# EAGLE board Data Logger V3.1 (EAGLE 9.4.0)
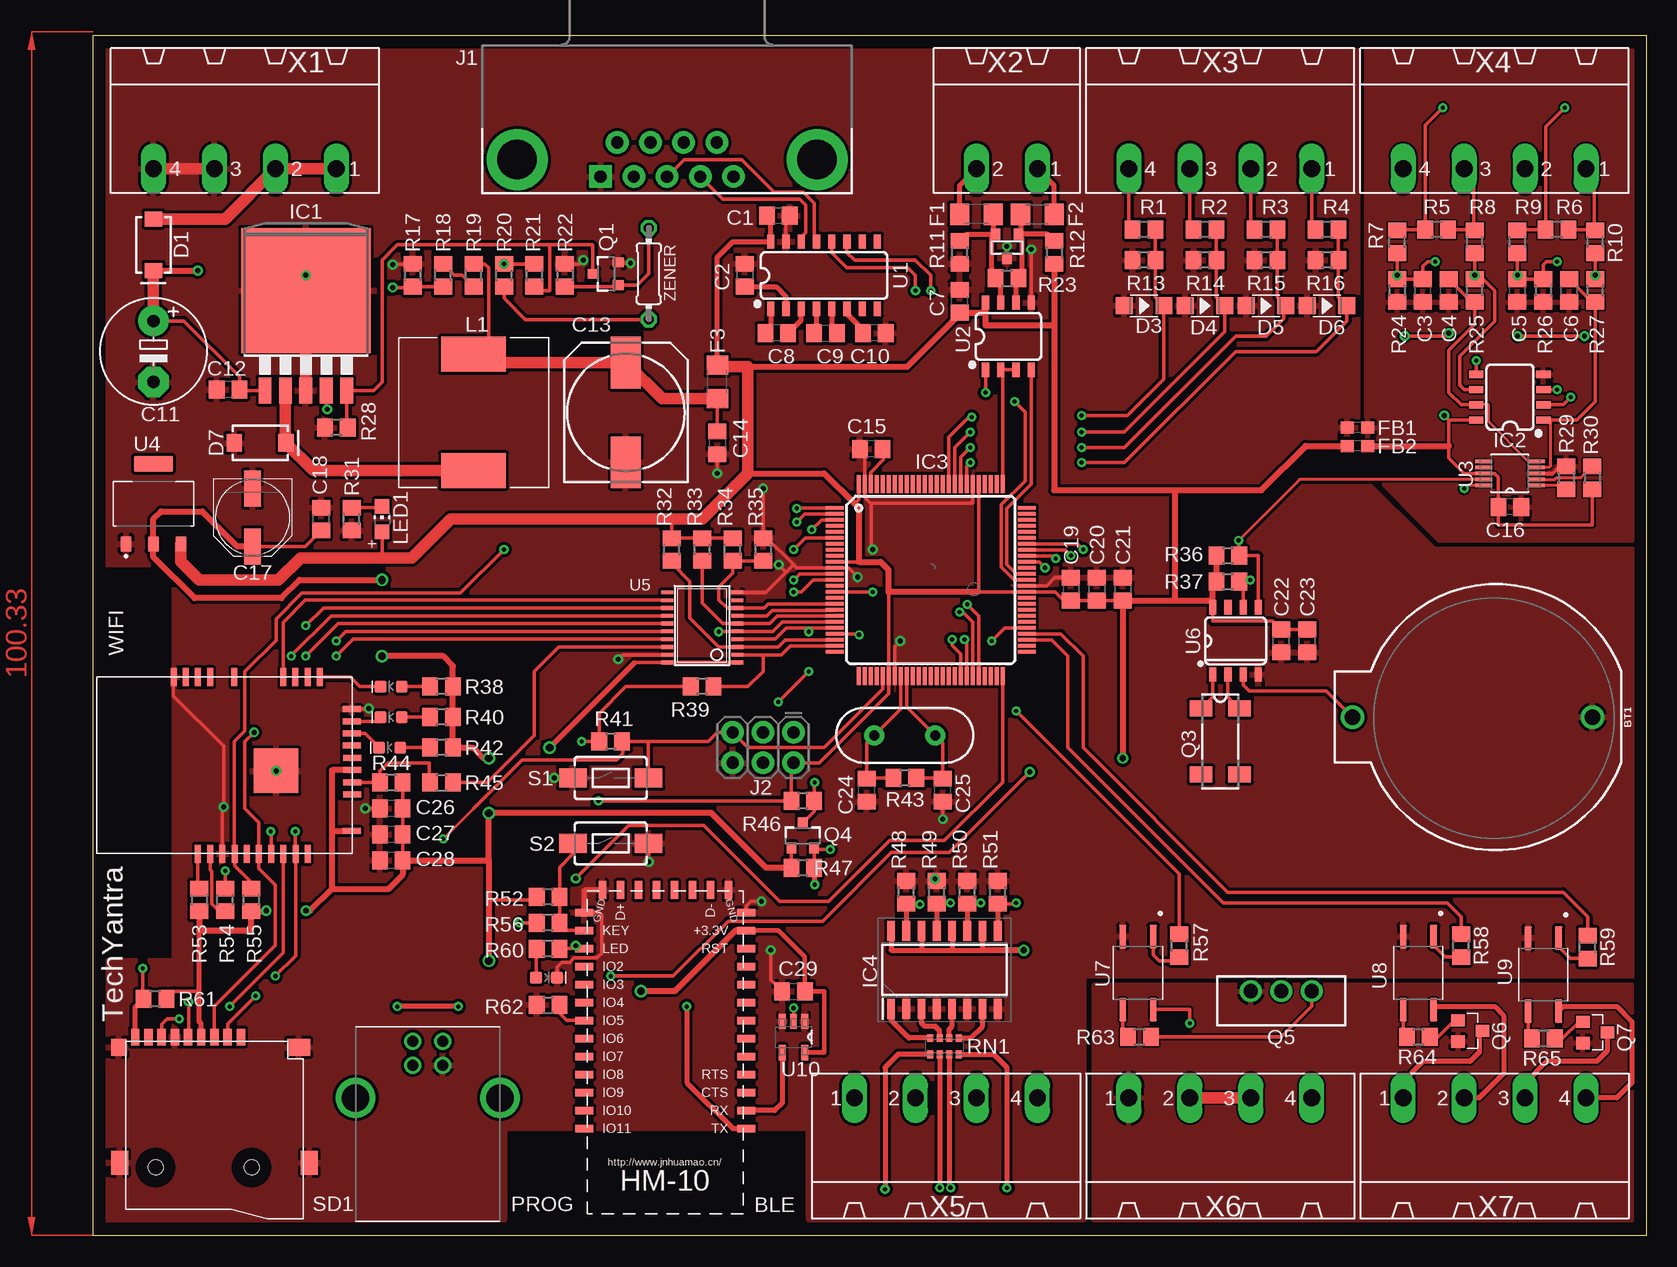
[diagram p3: board, top side]
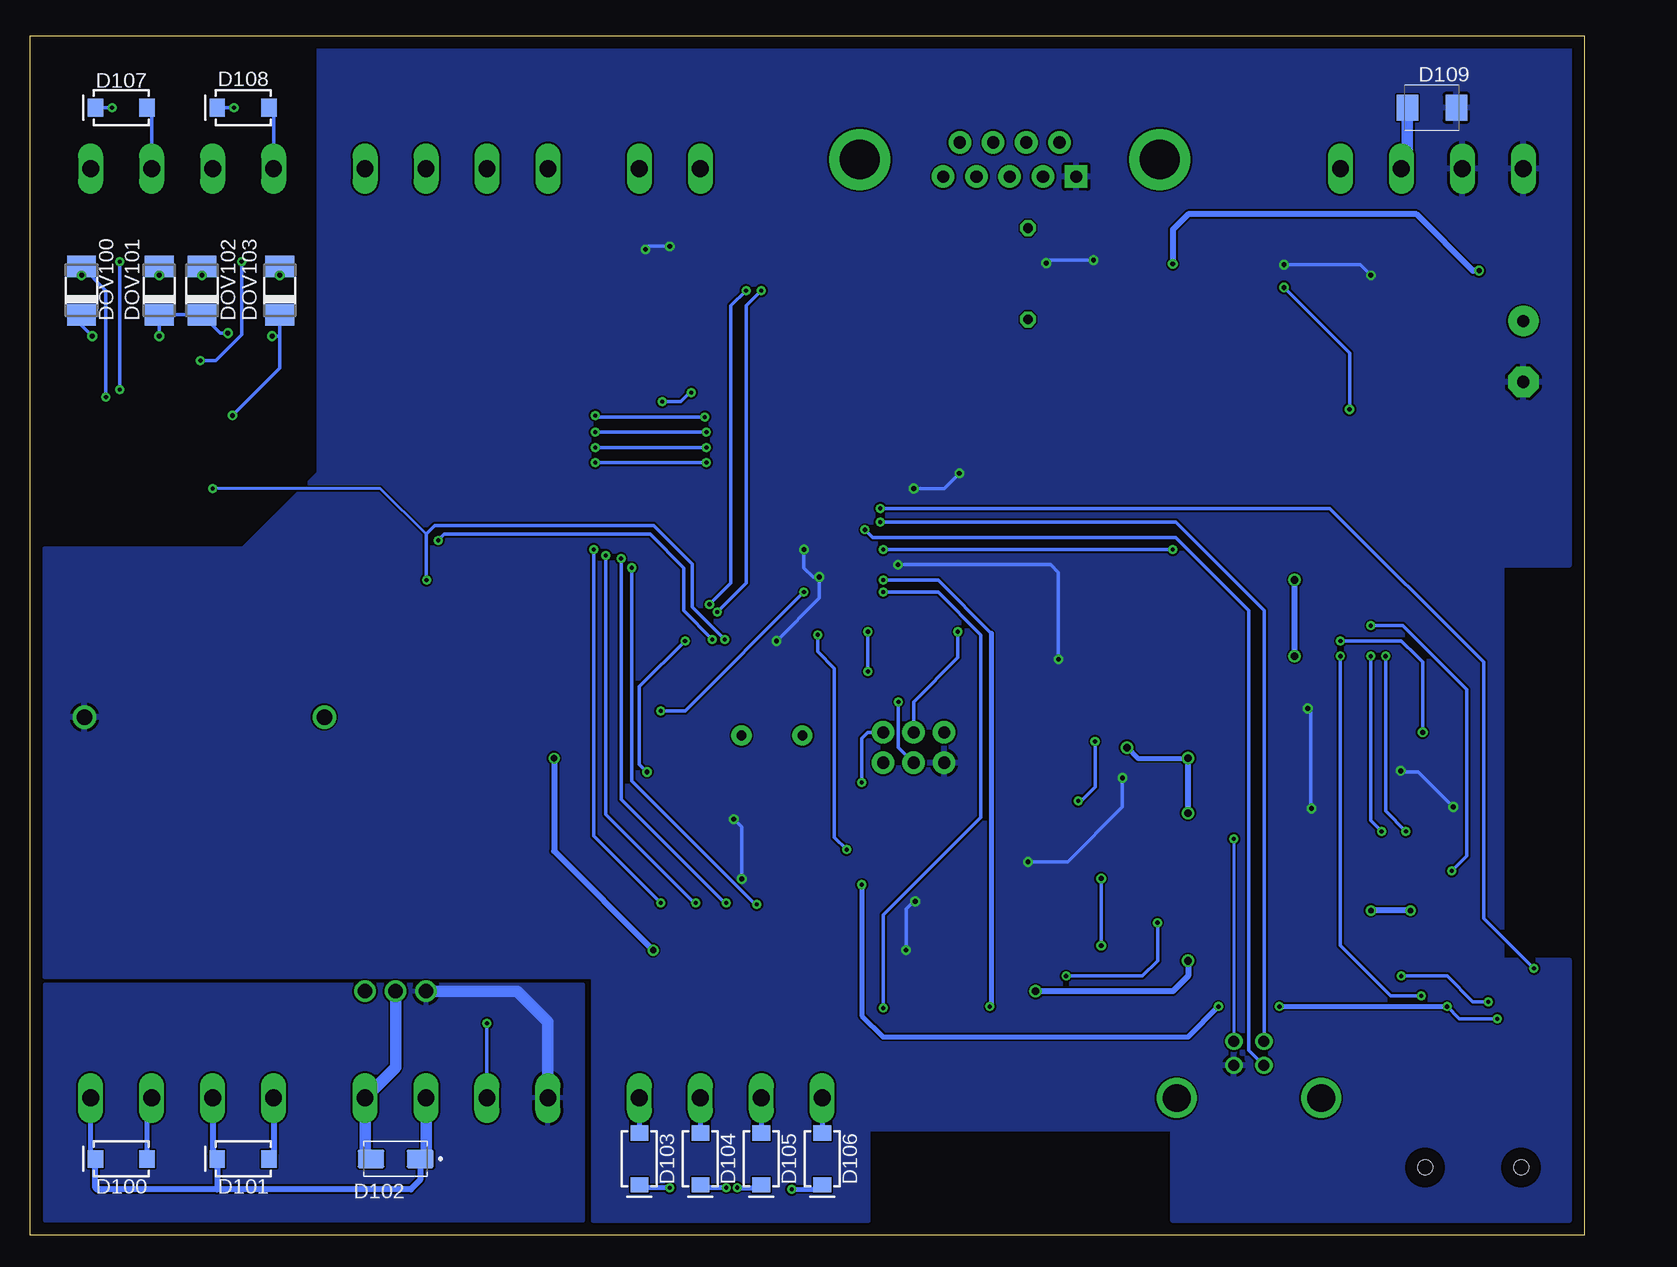
[diagram p4: board, bottom side, seen from below]

Size 129.52 x 100 mm. Coordinates in mm from the lower left corner, seen from the top.
Outline: 0,0 129.52,0 129.52,100 0,100 0,0
Copper layers (1*16): Top 0.035mm / dielectric 1.5mm / Bottom 0.035mm
Design rules "default": minimum track width 6mil, minimum drill 0.35mm, track to track 6mil, track to pad 6mil, pad to pad 6mil, via to via 6mil, smd to smd 6mil, copper to edge 40mil, drill to drill 6mil, minimum pad ring 10mil, minimum via ring 8mil, stop-mask expansion 4mil, vias tented up to drill 0mil, thermal gap 10mil

## Footprints (pad centres in the part's own frame; a part is rotated, then mirrored left to right if it is on the bottom)
26.9X13X2.2_BOARD = smd 1.5 x 0.635: 1 -7.5,0; 2 -7.5,-1.5; 3 -7.5,-3; 4 -7.5,-4.5; 5 -7.5,-6; 6 -7.5,-7.5; 8 -7.5,-10.5; 9 -7.5,-12; 10 -7.5,-13.5; 11 -7.5,-15; 12 -7.5,-16.5; 13 -7.5,-18; 22 6,-18; 23 6,-16.5; 24 6,-15; 25 6,-13.5; 26 6,-12; 27 6,-10.5; 28 6,-9; 29 6,-7.5; 30 6,-6; 31 6,-4.5; 32 6,-3; 33 6,-1.5; 34 6,0; $7 -7.5,-9 | smd 0.635 x 1.5: 14 -6,-19.875; 15 -4.5,-19.875; 16 -3,-19.875; 17 -1.5,-19.875; 18 0,-19.875; 19 1.5,-19.875; 20 3,-19.875; 21 4.5,-19.875
BATTCOM_20MM_PTH = drill 1.3: 1 11.85,0; 2 -8.15,0
C0805 = smd 1.3 x 1.5: 1 -0.95,0; 2 0.95,0
E5-8,5 = drill 1.016 pad 2.54: + -2.54,0 | drill 1.016 pad 2.54 octagon: - 2.54,0
150CLZ-1014 = smd 4.3 x 2.5: + 4.15,0; - -4.15,0
PANASONIC_D = smd 3 x 1.4: + 2.4,0; - -2.4,0
SMA-DIODE = smd 1.27 x 1.47: A -2.15,0; C 2.15,0
SOT-23-3 = smd 0.802 x 0.972: 1 -0.95,-1; 2 0.95,-1; 3 0,1
SOD-123 = smd 1.397 x 1.397: + -1.651,0; - 1.651,0
LED-0603 = smd 1 x 1: A -0.877,0; C 0.877,0
DIOM505270X240 = smd 2.21 x 1.53: A 2.05,0; C -2.05,0
SMBJ = smd 1.78 x 2.16: A 2.04,0; C -2.03,0
DO-214AC = smd 1.8 x 2.4: A 2.025,0; C -2.025,0
1206 = smd 1.6 x 1.8: 1 -1.4,0; 2 1.4,0
0603 = smd 1.1 x 1: 1 -0.85,0; 2 0.85,0
TO263-5 = smd 1.067 x 2.159: 1 -3.404,-5.791; 2 -1.702,-5.791; 3 0,-5.791; 4 1.702,-5.791; 5 3.404,-5.791 | smd 10.8 x 10.41: 6 0,2.54
SO08 = smd 0.6 x 1.2: 1 -1.905,-2.8; 2 -0.635,-2.8; 3 0.635,-2.8; 4 1.905,-2.8; 5 1.905,2.8; 6 0.635,2.8; 7 -0.635,2.8; 8 -1.905,2.8
TQFP100 = smd 1.5 x 0.3: 1 -8,6; 2 -8,5.5; 3 -8,5; 4 -8,4.5; 5 -8,4; 6 -8,3.5; 7 -8,3; 8 -8,2.5; 9 -8,2; 10 -8,1.5; 11 -8,1; 12 -8,0.5; 13 -8,0; 14 -8,-0.5; 15 -8,-1; 16 -8,-1.5; 17 -8,-2; 18 -8,-2.5; 19 -8,-3; 20 -8,-3.5; 21 -8,-4; 22 -8,-4.5; 23 -8,-5; 24 -8,-5.5; 25 -8,-6; 51 8,-6; 52 8,-5.5; 53 8,-5; 54 8,-4.5; 55 8,-4; 56 8,-3.5; 57 8,-3; 58 8,-2.5; 59 8,-2; 60 8,-1.5; 61 8,-1; 62 8,-0.5; 63 8,0; 64 8,0.5; 65 8,1; 66 8,1.5; 67 8,2; 68 8,2.5; 69 8,3; 70 8,3.5; 71 8,4; 72 8,4.5; 73 8,5; 74 8,5.5; 75 8,6 | smd 0.3 x 1.5: 26 -6,-8; 27 -5.5,-8; 28 -5,-8; 29 -4.5,-8; 30 -4,-8; 31 -3.5,-8; 32 -3,-8; 33 -2.5,-8; 34 -2,-8; 35 -1.5,-8; 36 -1,-8; 37 -0.5,-8; 38 0,-8; 39 0.5,-8; 40 1,-8; 41 1.5,-8; 42 2,-8; 43 2.5,-8; 44 3,-8; 45 3.5,-8; 46 4,-8; 47 4.5,-8; 48 5,-8; 49 5.5,-8; 50 6,-8; 76 6,8; 77 5.5,8; 78 5,8; 79 4.5,8; 80 4,8; 81 3.5,8; 82 3,8; 83 2.5,8; 84 2,8; 85 1.5,8; 86 1,8; 87 0.5,8; 88 0,8; 89 -0.5,8; 90 -1,8; 91 -1.5,8; 92 -2,8; 93 -2.5,8; 94 -3,8; 95 -3.5,8; 96 -4,8; 97 -4.5,8; 98 -5,8; 99 -5.5,8; 100 -6,8
SOIC127P700X230-16N = smd 1.65 x 0.65: 1 -3.25,4.445; 2 -3.25,3.175; 3 -3.25,1.905; 4 -3.25,0.635; 5 -3.25,-0.635; 6 -3.25,-1.905; 7 -3.25,-3.175; 8 -3.25,-4.445; 9 3.25,-4.445; 10 3.25,-3.175; 11 3.25,-1.905; 12 3.25,-0.635; 13 3.25,0.635; 14 3.25,1.905; 15 3.25,3.175; 16 3.25,4.445
DB9_MALE = drill 1.016 pad 1.88: 1 5.54,-1.42; 2 2.77,-1.42; 3 0,-1.42; 4 -2.77,-1.42; 6 4.15,1.42; 7 1.38,1.42; 8 -1.38,1.42; 9 -4.15,1.42 | drill 1.016 pad 1.88 square: 5 -5.54,-1.42 | drill 3.302 pad 5.08: G1 -12.5,0; G2 12.5,0
2X3-NS = drill 1.016 pad 1.88: 1 -2.54,-1.27; 2 -2.54,1.27; 3 0,-1.27; 4 0,1.27; 5 2.54,-1.27; 6 2.54,1.27
INDP125125X600N = smd 2.9 x 5.4: 1 -4.85,0; 2 4.85,0
CHIP-LED0805 = smd 1.2 x 1.2: A 0,-1.05; C 0,1.05
61400416121 = drill 0.92: 1 1.25,4.71; 2 -1.25,4.71; 3 -1.25,2.71; 4 1.25,2.71 | drill 2.3: Z1 -6.02,0; Z2 6.02,0
SOT23-3 = smd 0.8 x 0.9: 1 -0.95,-1; 2 0.95,-1; 3 0,1.1
HC49US = drill 0.813 pad 1.676: 1 -2.54,0; 2 2.54,0
MC-306 = smd 1.3 x 1.9: 1 -2.75,-1.6; 2 2.75,-1.6; 3 2.75,1.6; 4 -2.75,1.6
TO220 = drill 1.2 pad 1.8: 1 -2.54,0; 2 0,0; 3 2.54,0
SOT-23 = smd 1.016 x 1.143: 1 -0.889,-1.016; 2 0.889,-1.016; 3 0,1.016
R0805 = smd 1.3 x 1.5: 1 -0.95,0; 2 0.95,0
CAY16 = smd 0.5 x 0.65: 1 -1.2,-0.675; 2 -0.4,-0.675; 3 0.4,-0.675; 4 1.2,-0.675; 5 1.2,0.675; 6 0.4,0.675; 7 -0.4,0.675; 8 -1.2,0.675
TACTILE_SWITCH_SMD_6.0X3.5MM = smd 2.3 x 1.6: 1 -3.15,0; 2 3.15,0
TF-PULL = smd 0.7 x 1.4: 1 -2.2,-7.62; 2 -1.1,-7.62; 3 0,-7.62; 4 1.1,-7.62; 5 2.2,-7.62; 6 3.3,-7.62; 7 4.4,-7.62; 8 5.5,-7.62; 9 6.6,-7.62 | smd 1.4 x 2: S1 -7.9,2.85; S2 7.9,2.85 | smd 1.28 x 1.4: S3 7.96,-6.75 | smd 1.95 x 1.4: S4 -7.025,-6.75 | hole 1.25: -3.1,3.25; 4.9,3.25
SO16 = smd 0.6 x 1.2: 1 -4.445,-2.8; 2 -3.175,-2.8; 3 -1.905,-2.8; 4 -0.635,-2.8; 5 0.635,-2.8; 6 1.905,-2.8; 7 3.175,-2.8; 8 4.445,-2.8; 9 4.445,2.8; 10 3.175,2.8; 11 1.905,2.8; 12 0.635,2.8; 13 -0.635,2.8; 14 -1.905,2.8; 15 -3.175,2.8; 16 -4.445,2.8
SOP50P490X110-10N = smd 1.422 x 0.279: 1 -2.184,0.991; 2 -2.184,0.508; 3 -2.184,0; 4 -2.184,-0.508; 5 -2.184,-0.991; 6 2.184,-0.991; 7 2.184,-0.508; 8 2.184,0; 9 2.184,0.508; 10 2.184,0.991
SOT229P700X180-4N = smd 0.93 x 1.31: 1 -2.29,-3.345; 2 0,-3.345; 3 2.29,-3.345 | smd 3.24 x 1.31: 4 0,3.345
TSSOP20 = smd 0.305 x 0.991: 1 -3.075,-2.918; 2 -2.425,-2.918; 3 -1.775,-2.918; 4 -1.125,-2.918; 5 -0.475,-2.918; 6 0.175,-2.918; 7 0.825,-2.918; 8 1.475,-2.918; 9 2.125,-2.918; 10 2.775,-2.918; 11 2.775,2.918; 12 2.125,2.918; 13 1.475,2.918; 14 0.825,2.918; 15 0.175,2.918; 16 -0.475,2.918; 17 -1.125,2.918; 18 -1.775,2.918; 19 -2.425,2.918; 20 -3.075,2.918
SO08-0.15 = smd 0.6 x 1.2: 1 -1.905,-2.8; 2 -0.635,-2.8; 3 0.635,-2.8; 4 1.905,-2.8; 5 1.905,2.8; 6 0.635,2.8; 7 -0.635,2.8; 8 -1.905,2.8
SOP254P700X200-4N = smd 1.93 x 0.59: 1 -3.04,1.27; 2 -3.04,-1.27; 3 3.04,-1.27; 4 3.04,1.27
SOT95P280X145-5N = smd 1.27 x 0.559: 1 -1.295,0.94; 2 -1.295,0; 3 -1.295,-0.94; 4 1.295,-0.94; 5 1.295,0.94
ATWINC1500_MR210PA = smd 1.5 x 0.5: J1 7.146,-4.973; J2 7.146,-3.957; J3 7.146,-2.941; J4 7.146,-1.925; J5 7.146,2.139; J6 7.146,4.171; J7 7.146,5.187; J8 7.146,6.203; J9 7.146,7.219; J10 -7.584,5.181; J11 -7.584,4.165; J12 -7.584,3.149; J13 -7.584,2.133; J14 -7.584,1.117; J15 -7.584,0.101; J16 -7.584,-0.915; J17 -7.584,-1.931; J18 -7.584,-2.947; J19 -7.584,-3.963 | smd 0.5 x 1.5: J20 -5.684,-7.643; J21 -2.636,-7.663; J22 -1.62,-7.663; J23 -0.604,-7.663; J24 0.412,-7.663; J25 1.428,-7.643; J26 2.444,-7.643; J27 3.46,-7.643; J28 4.476,-7.643 | smd 3.7 x 3.7: MTGND -0.666,-1.331
MSTBA4 = drill 1.397 long: 1 -7.62,5.08; 2 -2.54,5.08; 3 2.54,5.08; 4 7.62,5.08
MSTBA2 = drill 1.397 long: 1 -2.54,5.08; 2 2.54,5.08
0204/7 = drill 0.813 octagon: 1 -3.81,0; 2 3.81,0

## Placement (x,y rotation side)
BLE  HM-10-BOARD  [26.9X13X2.2_BOARD]  46.99,8.89 180 top
BT1  [BATTCOM_20MM_PTH]  116.84,43.18 180 top
C1  0.1uf  [C0805]  57.15,84.96 180 top
C2  0.1uf  [C0805]  54.36,80.01 270 top
C3  0.1uf  [C0805]  110.87,78.74 90 top
C4  0.1uf  [C0805]  113.03,78.74 90 top
C5  0.1uf  [C0805]  118.75,78.74 90 top
C6  0.1uf  [C0805]  123.06,78.74 90 top
C7  104  [C0805]  72.26,77.85 90 top
C8  0.1uf  [C0805]  57.02,75.18 180 top
C9  0.1uf  [C0805]  61.09,75.18 0 top
C10  0.1uf  [C0805]  65.15,75.18 180 top
C11  470uf  [E5-8,5]  5.08,73.66 270 top
C12  104  [C0805]  11.3,70.48 180 top
C13  220uf  [150CLZ-1014]  44.45,68.58 90 top
C14  104  [C0805]  52.07,66.04 270 top
C15  104  [C0805]  64.9,65.53 180 top
C16  0.1uf  [C0805]  118.11,60.71 180 top
C17  100uF  [PANASONIC_D]  13.34,59.82 270 top
C18  104  [C0805]  19.05,59.69 90 top
C19  104  [C0805]  81.53,53.85 270 top
C20  104  [C0805]  83.69,53.85 270 top
C21  104  [C0805]  85.85,53.85 270 top
C22  10uf  [C0805]  99.06,49.53 90 top
C23  104  [C0805]  101.22,49.53 90 top
C24  104  [C0805]  64.52,37.08 90 top
C25  104  [C0805]  70.87,37.08 90 top
C26  10uf  [C0805]  24.89,35.56 180 top
C27  10uf  [C0805]  24.89,33.4 180 top
C28  104  [C0805]  24.89,31.24 180 top
C29  1uf  [C0805]  58.42,20.32 0 top
D1  3A/40V/500mV  [SMA-DIODE]  5.08,82.55 270 top
D2  SM712  [SOT-23-3]  76.2,82.42 180 top
D3  SMD-DIODE-ZENER-5.1V-500MW(SOD-123)  [SOD-123]  87.63,77.47 0 top
D4  SMD-DIODE-ZENER-5.1V-500MW(SOD-123)  [SOD-123]  92.71,77.47 0 top
D5  SMD-DIODE-ZENER-5.1V-500MW(SOD-123)  [SOD-123]  97.79,77.47 0 top
D6  SMD-DIODE-ZENER-5.1V-500MW(SOD-123)  [SOD-123]  102.87,77.47 0 top
D7  3A/40V/500mV  [SMA-DIODE]  13.97,66.04 0 top
D8  LED3  [LED-0603]  24.89,45.72 180 top
D9  LED2  [LED-0603]  24.89,43.18 180 top
D10  LED1  [LED-0603]  24.77,40.64 180 top
D11  LED5  [LED-0603]  37.85,21.46 0 top
D100  3A/40V/500mV  [SMA-DIODE]  121.92,6.35 180 bottom
D101  3A/40V/500mV  [SMA-DIODE]  111.76,6.35 180 bottom
D102  M7  [DIOM505270X240]  99.06,6.35 180 bottom
D103  3A/40V/500mV  [SMA-DIODE]  78.74,6.35 270 bottom
D104  3A/40V/500mV  [SMA-DIODE]  73.66,6.35 270 bottom
D105  3A/40V/500mV  [SMA-DIODE]  68.58,6.35 270 bottom
D106  3A/40V/500mV  [SMA-DIODE]  63.5,6.35 270 bottom
D107  3A/40V/500mV  [SMA-DIODE]  121.92,93.98 180 bottom
D108  3A/40V/500mV  [SMA-DIODE]  111.76,93.98 180 bottom
D109  SMBJ26CA  [SMBJ]  12.7,93.98 0 bottom
DOV100  SS14  [DO-214AC]  125.22,78.74 90 bottom
DOV101  SS14  [DO-214AC]  118.75,78.74 90 bottom
DOV102  SS14  [DO-214AC]  115.19,78.74 90 bottom
DOV103  SS14  [DO-214AC]  108.71,78.74 90 bottom
F1  6V/0.5A  [1206]  73.66,85.09 180 top
F2  6V/0.5A  [1206]  78.74,85.09 0 top
F3  6V/0.5A  [1206]  52.07,71.12 90 top
FB1  30Ω/1.8A  [0603]  105.41,67.31 180 top
FB2  30Ω/1.8A  [0603]  105.41,65.79 180 top
IC1  [TO263-5]  17.78,76.2 0 top
IC2  OP-AMP  [SO08]  118.11,69.85 90 top
IC3  ATMEGA2560-16AU  [TQFP100]  69.85,54.61 0 top
IC4  TLP292-4(V4-LA,E  [SOIC127P700X230-16N]  70.99,22.1 90 top
J1  [DB9_MALE]  47.88,89.66 0 top
J2  AVR_SPI_PROG_3X2NS  [2X3-NS]  55.88,40.64 180 top
L1  SRR1260-680M  [INDP125125X600N]  31.75,68.58 270 top
LED1  [CHIP-LED0805]  24.13,59.69 0 top
PROG  61400416121  [61400416121]  27.94,11.43 0 top
Q1  600mA/40V  [SOT23-3]  42.8,80.14 90 top
Q2  16M  [HC49US]  67.69,41.66 180 top
Q3  MC-306  [MC-306]  93.98,41.15 270 top
Q4  BSS138  [SOT23-3]  59.18,33.27 0 top
Q5  TIP120  [TO220]  99.06,20.32 180 top
Q6  TRANSISTOR-NPN  [SOT-23]  114.81,17.02 270 top
Q7  TRANSISTOR-NPN  [SOT-23]  125.22,16.89 270 top
R1  100k  [R0805]  87.63,83.82 180 top
R2  100k  [R0805]  92.71,83.82 180 top
R3  100k  [R0805]  97.79,83.82 180 top
R4  100k  [R0805]  102.87,83.82 180 top
R5  100  [R0805]  112.01,83.82 180 top
R6  100  [R0805]  122.05,83.82 180 top
R7  1 M  [R0805]  108.71,82.8 90 top
R8  1 M  [R0805]  115.19,82.8 90 top
R9  1 M  [R0805]  118.75,82.8 90 top
R10  1 M  [R0805]  125.22,82.8 90 top
R11  1k  [R0805]  72.26,81.92 90 top
R12  1k  [R0805]  80.14,81.92 270 top
R13  100k  [R0805]  87.63,81.28 180 top
R14  100k  [R0805]  92.71,81.28 180 top
R15  100k  [R0805]  97.79,81.28 180 top
R16  100k  [R0805]  102.87,81.28 180 top
R17  1k  [R0805]  26.67,80.01 270 top
R18  0 ohm  [R0805]  29.21,80.01 90 top
R19  3k  [R0805]  31.75,80.01 90 top
R20  10k  [R0805]  34.29,80.01 90 top
R21  47k  [R0805]  36.83,80.01 90 top
R22  10k  [R0805]  39.37,80.01 270 top
R23  120  [R0805]  76.2,79.76 0 top
R24  1 M  [R0805]  108.71,78.74 270 top
R25  1 M  [R0805]  115.19,78.74 90 top
R26  1 M  [R0805]  120.9,78.74 270 top
R27  1 M  [R0805]  125.22,78.74 90 top
R28  0 ohm  [R0805]  20.32,67.31 180 top
R29  10 K  [R0805]  122.81,63.12 270 top
R30  10 K  [R0805]  124.97,63.12 270 top
R31  1k  [R0805]  21.59,59.69 90 top
R32  100K  [R0805]  48.26,57.15 90 top
R33  100K  [R0805]  50.8,57.15 90 top
R34  0 ohm  [R0805]  53.34,57.15 90 top
R35  100K  [R0805]  55.88,57.15 270 top
R36  2.2k  [R0805]  94.61,56.64 0 top
R37  2.2k  [R0805]  94.61,54.48 0 top
R38  1K  [R0805]  29.08,45.72 180 top
R39  100K  [R0805]  50.8,45.72 180 top
R40  1K  [R0805]  29.08,43.18 180 top
R41  10k  [R0805]  43.18,41.15 180 top
R42  1K  [R0805]  29.08,40.64 180 top
R43  1M  [R0805]  67.69,38.1 180 top
R44  0ohm  [R0805]  24.89,37.72 180 top
R45  0ohm  [R0805]  29.08,37.72 0 top
R46  10K  [R0805]  59.18,36.2 180 top
R47  10K  [R0805]  59.18,30.61 180 top
R48  1 K  [R0805]  67.82,28.57 90 top
R49  1 K  [R0805]  70.36,28.57 90 top
R50  1 K  [R0805]  72.9,28.57 90 top
R51  1 K  [R0805]  75.44,28.57 90 top
R52  10k  [R0805]  37.97,28.19 180 top
R53  100K  [R0805]  8.89,27.94 270 top
R54  0ohm  [R0805]  11.05,27.94 90 top
R55  10K  [R0805]  13.21,27.94 270 top
R56  0 OHM  [R0805]  37.97,26.04 180 top
R57  1K  [R0805]  90.55,24.13 90 top
R58  1K  [R0805]  114.05,24.13 90 top
R59  1K  [R0805]  124.59,24 90 top
R60  1k  [R0805]  37.97,23.88 180 top
R61  1k  [R0805]  5.21,19.68 180 top
R62  0 ohm  [R0805]  37.97,19.18 0 top
R63  10K  [R0805]  87.25,16.51 180 top
R64  1K  [R0805]  110.49,16.51 180 top
R65  1K  [R0805]  120.9,16.38 180 top
RN1  1k  [CAY16]  70.99,15.75 180 top
S1  MOMENTARY-SWITCH-SPST-SMD-6.0X3.5MM  [TACTILE_SWITCH_SMD_6.0X3.5MM]  43.18,38.1 0 top
S2  MOMENTARY-SWITCH-SPST-SMD-6.0X3.5MM  [TACTILE_SWITCH_SMD_6.0X3.5MM]  43.18,32.64 0 top
SD1  TF-HOLDER  [TF-PULL]  10.16,8.89 180 top
U1  MAX3232  [SO16]  60.96,80.01 0 top
U2  MAX3485CSA  [SO08]  76.33,74.93 0 top
U3  ADS1115IDGST  [SOP50P490X110-10N]  118.11,63.5 180 top
U4  AMS1117-3.3  [SOT229P700X180-4N]  5.08,60.96 0 top
U5  74LVC245  [TSSOP20]  50.8,50.8 90 top
U6  DS1307Z  [SO08-0.15]  95.25,49.53 0 top
U7  EL357N(A)(TA)-G  [SOP254P700X200-4N]  87.12,21.84 270 top
U8  EL357N(A)(TA)-G  [SOP254P700X200-4N]  110.49,21.84 270 top
U9  EL357N(A)(TA)-G  [SOP254P700X200-4N]  120.9,21.72 270 top
U10  SN74LVC1G125DBVR  [SOT95P280X145-5N]  58.42,16.51 270 top
WIFI  ATWINC1500_MR210PB  [ATWINC1500_MR210PA]  13.97,39.37 90 top
X1  MSTBA4  [MSTBA4]  12.7,93.98 180 top
X2  MSTBA2  [MSTBA2]  76.2,93.98 180 top
X3  MSTBA4  [MSTBA4]  93.98,93.98 180 top
X4  MSTBA4  [MSTBA4]  116.84,93.98 180 top
X5  MSTBA4  [MSTBA4]  71.12,6.35 0 top
X6  MSTBA4  [MSTBA4]  93.98,6.35 0 top
X7  MSTBA4  [MSTBA4]  116.84,6.35 0 top
ZENER  [0204/7]  46.35,80.14 270 top

## Tracks (layer width: path | path; a pad name or v marks a point on that pad's centre or on a via)
3.3V  (via drill 0.46, 0.64)
  Top 0.305: C17.+ 17.73,57.42 C18.1 | R44.1 C26.1 C27.1 C28.1 | R61.1 6.79,20.32 8.89,20.32 | Q4.1 R47.2 | R52.2 36.77,27.94 33.02,27.94 | U5.1 U5.20 45.19,47.73
  Top 0.381: 60.96,15.24 60.96,20.32 C29.2 59.37,23.18 57.16,25.39 BLE.12 | 60.94,15.21 U10.5
  Top 0.406: 60.96,15.24 60.94,15.21 | SD1.4 9.06,17.61 8.89,17.78 8.89,20.32 8.89,25.4 | 19.97,38.77 19.94,38.73 | 19.94,33.66 19.97,33.69 | C28.1 | 14.42,26.99 v14.48,27.05 | v17.78,27.05 18.16,27.05 | 45.19,47.73 v38.1,40.64
  Top 0.508: C17.+ 12.06,57.42 9.16,60.33 5.71,60.33 5.08,59.69 U4.2 5.08,56.52 8.51,53.09 15.73,53.09 17.26,54.61 v24.13,54.61 | R53.2 8.89,25.4 13.21,25.4 R55.2 14.42,26.99 | 33.02,31.24 C28.1 25.84,30.03 24.64,28.83 19.94,28.83 | WIFI.J23 19.97,38.77 | 19.94,38.73 19.94,33.66 19.94,28.83 | 19.97,33.69 WIFI.J20 | 18.16,27.05 19.94,28.83 | v24.13,48.26 29.21,48.26 30.03,47.44 R38.1 R40.1 R42.1 31.68,40.64 32.57,39.75 v33.02,39.75 | R47.2 56.13,30.61 51.56,35.18 v33.02,35.18 33.02,31.24 | BLE.12 53.58,25.39 48.51,20.32 v45.72,20.32 | 33.02,31.24 33.02,27.94 v33.02,22.86
  Bottom 0.406: v38.1,40.64 37.21,39.75 v33.02,39.75
  Bottom 0.508: v14.48,27.05 v17.78,27.05 | v24.13,48.26 v24.13,54.61 | v45.72,20.32 34.29,20.32 33.02,21.59 v33.02,22.86 | v33.02,35.18 v33.02,39.75
5V  (via drill 0.35, 0.51)
  Top 0.254: 93.28,52.9 93.34,52.83
  Top 0.305: C21.2 C20.2 C19.2 81.09,52.9 81.03,52.83 80.25,53.61 IC3.61 73.79,53.61 73.85,53.67 IC3.80 | 93.34,52.83 U6.8 93.34,51.18 98.36,51.18 C22.2 C23.2 | 93.34,54.16 R37.1 | 65.68,56.11 65.66,56.13 | IC3.10 63.88,56.11 63.85,56.14 | 66.37,53.61 66.35,53.59 IC3.31 66.35,45.14 60.58,39.37 J2.2 58.23,39.18 R46.2 v42.16,36.2 | R34.2 R33.2 R32.2 48.26,59.69 | R39.2 44.45,45.72 42.23,43.5 R41.2 v40.77,41.15 | IC3.100 63.85,61.31 63.5,60.96 | LED1.A 24.13,56.45
  Top 0.406: C1.2 56.52,84.65 U1.16 53.34,82.8 52.07,81.53 F3.2 | IC4.16 66.55,23.75 69.09,23.75 | 69.09,23.75 71.63,23.75 | 71.63,23.75 74.17,23.75 IC4.10 | IC4.12 71.63,23.75 | IC4.14 69.09,23.75
  Top 0.508: R37.1 R36.1 | 93.34,52.83 93.34,54.16 | 66.35,53.59 66.35,55.44 65.68,56.11 63.88,56.11 | 73.79,53.61 66.37,53.61 | R12.2 80.14,75.82 | 80.14,75.82 74.42,75.82 74.42,76.83 | 74.42,76.83 U2.8 | C7.1 72.39,76.9 | 72.39,76.9 74.36,76.9 74.42,76.83 | 90.17,52.9 C21.2 v85.85,39.75 | 90.17,52.9 93.28,52.9 | 54.61,63.5 60.96,63.5 63.5,60.96 63.85,60.61 63.85,56.14 | 54.61,72.39 67.88,72.39 72.39,76.9 | 80.14,75.82 80.14,62.1 90.17,62.1 | 90.17,62.1 97.41,62.1 101.09,65.79 FB2.2 | 90.17,62.1 90.17,52.9 | v77.6,23.75 74.17,23.75
  Top 0.965: U4.3 7.37,56.13 8.89,54.61 15.49,54.61 17.34,56.45 24.13,56.45 26.61,56.45 29.84,59.69 48.26,59.69 50.8,59.69 54.61,63.5 54.61,72.39 52.2,72.39 F3.2
  Bottom 0.305: v42.16,36.2 41.91,36.2 40.77,37.34 v40.77,41.15
  Bottom 0.508: v85.85,39.75 85.85,32 v77.6,23.75
12V  (via drill 0.41)
  Top 0.305: R20.2 R21.2 | IC1.1 12.33,70.41 C12.1 12.25,71.57 7.62,76.2 C11.+
  Top 0.508: D1.C v8.75,80.4 v8.76,80.39 8.89,80.26
  Top 0.965: D1.C C11.+
  Bottom 0.508: v8.76,80.39 9.27,80.39 13.97,85.09 33.02,85.09 34.29,83.82 R20.2
  other vias: 34.29,80.96
!ATWINC_IRQ  (via drill 0.35)
  Top 0.305: R55.1 13.21,29.4 11.84,30.77 WIFI.J13 11.81,31.81 11.81,41.15 12.7,42.04 12.7,46.99 15.29,49.58 15.29,51.37 17.43,53.51 30.65,53.51 v34.29,57.15 | IC3.6 59.38,58.11 v58.42,57.15
  Bottom 0.305: v58.42,57.15 v34.29,57.15
!ATWINC_RST_3V
  Top 0.305: U5.12 17.75,52.92 15.88,51.05 15.88,46.54 WIFI.J4
!ATWINC_RST_5V
  Top 0.305: IC3.17 56.29,52.61 55.96,52.27 U5.8 52.88,52.27 52.2,52.96 52.2,54.04 53.34,55.18 R34.1 R35.2
+12V  (via drill 0.35)
  Top 0.305: U7.4 91.44,18.8 v91.44,17.65
  Top 0.406: U9.4 122.55,19.05 127,19.05 128.27,17.78 128.27,12.7 127,11.43 X7.4 | U8.4 112.01,19.05 116.84,19.05 117.6,18.29 117.6,13.46 115.57,11.43 X7.2
  Top 0.965: X6.3 X6.2
  Bottom 0.305: v91.44,17.65 X6.2
  Bottom 0.406: D100.C 124.2,6.48 124.46,6.74 X7.4
  Bottom 0.508: X7.2 114.3,6.74 D101.C | D102.C 97.01,4.59 97.79,3.81 113.92,3.81 | 114.3,5.96 D101.C | 124.2,6.48 D100.C 124.08,3.94 123.95,3.81 113.92,3.81 | D101.C 113.91,3.82 113.92,3.81
  Bottom 0.965: X6.3 96.52,6.84 D102.C
AGND
  Top 0.279: U3.3 121.67,63.5 122.23,64.07
  Top 0.305: 122.23,64.07 R29.1
  pour Top: 106.17,99.06 128.27,99.06 128.27,57.91 112.27,57.91 106.17,64.01
AIN0
  Top 0.254: U3.4 121.41,64.01 121.54,64.14 121.54,67.94
  Top 0.305: C6.2 124.96,77.79 R27.1 125.22,69.47 123.7,67.94 121.54,67.94 IC2.1
AIN1
  Top 0.254: U3.5 119.66,64.49 116.33,67.82 116.33,69.22 IC2.7
  Top 0.305: C4.2 114.93,77.79 R25.1 115.19,75.95 113.03,73.79 113.03,70.23 114.05,69.22 IC2.7
AIN2  (via drill 0.35)
  Top 0.305: R4.1 R16.1 103.82,78.17 D6.- 104.52,76.2 101.98,73.66 95.25,73.66 85.98,64.39 v82.42,64.39 | IC3.82 72.85,64.09 v73.15,64.39
  Bottom 0.305: v82.42,64.39 v73.15,64.39
AIN3  (via drill 0.35)
  Top 0.305: R3.1 R15.1 98.74,78.17 99.25,77.66 | 99.25,77.66 D5.- | IC3.83 72.35,64.86 v73.15,65.66 | v82.42,65.66 85.98,65.66 95.25,74.93 97.79,74.93 99.25,76.39 99.25,77.66
  Bottom 0.305: v73.15,65.66 v82.42,65.66
AIN4  (via drill 0.35)
  Top 0.305: R2.1 R14.1 93.66,78.17 D4.- 94.36,75.31 85.98,66.93 v82.42,66.93 | IC3.84 71.85,65.63 v73.15,66.93
  Bottom 0.305: v73.15,66.93 v82.42,66.93
AIN5  (via drill 0.35)
  Top 0.305: R1.1 R13.1 88.58,78.17 D3.- | D3.- 89.28,77.85 | D3.- 89.28,71.37 86.23,68.33 v82.42,68.33 | IC3.85 71.35,66.52 73.03,68.2 v73.28,68.2
  Bottom 0.305: v73.28,68.2 82.3,68.2 v82.42,68.33
AREF
  Top 0.305: IC3.98 64.85,63.58 65.91,64.64 65.91,65.47 C15.1
ATWINC_CS_3V  (via drill 0.35)
  Top 0.305: U5.14 19.88,51.62 16.51,48.26 v16.56,48.26 | v14.86,33.66 14.88,33.63 WIFI.J16
  Bottom 0.305: v16.56,48.26 16.56,35.35 v14.86,33.66
ATWINC_CS_5V
  Top 0.305: IC3.19 57.07,51.61 56.44,50.98 U5.6 52.53,50.98 50.8,52.7 R33.1
ATWINC_EN_3V
  Top 0.305: U5.18 38.87,49.02 36.83,46.99 36.83,41.66 32.89,37.72 R45.2
ATWINC_EN_5V
  Top 0.305: 55.88,48.38 57.39,48.38 58.13,49.11 IC3.24 | 55.88,48.38 U5.2 | 51.82,45.79 R39.1 54.61,45.72 55.88,46.99 55.88,48.38
BLE_DISCONNECT  (via drill 0.35, 0.41)
  Top 0.305: IC3.55 76.01,50.61 v74.93,49.53 | v35.56,26.04 R56.2 | v43.18,21.59 48.39,21.59 52.96,26.16 60.83,26.16 66.55,31.88 71.37,31.88 v78.11,38.61
  Bottom 0.305: v74.93,49.53 78.74,45.72 78.74,39.24 v78.11,38.61 | v43.18,21.59 36.83,21.59 35.56,22.86 v35.56,26.04
BLE_RX  (via drill 0.35)
  Top 0.305: IC3.12 58.92,55.11 v58.42,54.61
  Top 0.406: v49.53,19.05 49.53,12.7 53.34,8.89 BLE.1
  Bottom 0.305: v58.42,54.61 53.85,54.61 49.4,50.16
  Bottom 0.406: 49.4,50.16 49.4,19.18 v49.53,19.05
BLE_STATE  (via drill 0.41)
  Top 0.254: 75.82,46.58 IC3.50
  Top 0.305: BLE.24 40.13,23.89 | 40.13,23.89 38.94,23.89 R60.1 | IC3.50 75.85,37.75 70.99,32.89 66.42,32.89 61.34,27.81 57.28,27.81 50.93,34.16 44.7,34.16 v40.26,29.72 | v40.26,24.13 40.26,24.02 40.13,23.89
  Bottom 0.305: v40.26,29.72 v40.26,24.13
BLE_TX  (via drill 0.35)
  Top 0.305: IC3.13 60.07,54.61 59.05,53.59 v58.42,53.59 | v58.42,18.92 U10.2
  Bottom 0.305: v58.42,53.59 53.85,53.59 50.29,50.04 50.29,34.8 58.42,26.67 v58.42,18.92
BLE_TX_3V
  Top 0.406: U10.4 57.48,11 56.87,10.39 BLE.2
DIN_1  (via drill 0.35)
  Top 0.305: IC3.66 78.89,56.11 v79.38,55.63 | v68.95,27.56 67.94,27.56 67.82,27.43
  Top 0.406: R48.1 67.82,27.43 IC4.15
  Bottom 0.305: v79.38,55.63 79.38,37.85 69.09,27.56 v68.95,27.56
DIN_2  (via drill 0.35)
  Top 0.305: IC3.67 80.04,56.61 v80.26,56.39 | v71.49,27.69 70.42,27.69 R49.1
  Top 0.406: R49.1 IC4.13
  Bottom 0.305: v80.26,56.39 80.26,36.32 71.63,27.69 v71.49,27.69
DIN_3  (via drill 0.35)
  Top 0.305: IC3.68 81.07,57.11 v81.53,56.64 | v74.03,27.69 72.96,27.69 R50.1
  Top 0.406: R50.1 IC4.11
  Bottom 0.305: v81.53,56.64 81.53,35.05 74.17,27.69 v74.03,27.69
DIN_4  (via drill 0.35)
  Top 0.305: R51.1 76.9,27.62 v76.96,27.69 | IC3.69 82.09,57.61 v82.55,57.15
  Top 0.406: R51.1 IC4.9
  Bottom 0.305: v82.55,57.15 82.55,33.27 v76.96,27.69
GND  (via drill 0.41)
  Top 0.305: 58.42,55.88 58.69,55.61 IC3.11 63.01,55.61 v63.75,54.86 | 58.42,55.88 56.2,58.1 R35.1 v55.88,62.23 | IC3.62 79.51,54.11 80.2,54.8 C19.1 | IC3.81 73.35,61 64.9,61 64.9,57.28 v65.02,57.15 | 64.81,61 64.35,61.47 IC3.99 64.35,65.13 C15.2 | D11.C 38.72,22.34 39.12,22.73 39.75,22.73 40.13,23.11 42.04,23.11 42.42,23.5 42.42,26.67 42.16,26.92 42.13,26.89 BLE.22 | S2.2 46.33,31.14 v46.35,31.11 | v38.48,38.1 S1.1 | WIFI.J28 22.89,43.85 22.99,43.94 v23.03,43.9 | v22.73,35.56 C26.2 | C29.1 56.52,21.27 v56.52,23.75 | v55.75,27.81 54.86,27.81 54.48,27.43 54.49,27.43 BLE.13 | R49.2 v70.2,29.68 | v70.87,34.67 C25.1 | v52.07,63.5 C14.2 | R17.1 25.08,80.96 v25.02,80.9 | v17.78,80.01 IC1.6 | WIFI.J12 10.82,35.66 10.79,35.69 v10.92,35.69 10.92,40.77 6.73,44.96 6.73,46.5 WIFI.J9 | U5.10 56.12,53.58 57.78,55.24 | 57.78,55.24 58.42,55.88 | IC3.32 66.85,49.07 v67.31,49.53 | U5.19 44.18,48.38 v43.81,48.01 | v57.19,55.88 57.78,55.28 57.78,55.24 | R22.1 40.57,80.96 v40.89,81.28 | v44.83,81.03 43.86,81.03 Q1.2 | U1.15 57.78,84.65 C1.1 | U2.5 v78.23,82.17 | v76.2,82.42 D2.3
  Top 0.457: BLE.22 40.99,28.67 41.08,28.77 BLE.21
  Top 0.965: IC1.3 IC1.6 | X1.4 X1.3
  Bottom 0.305: v46.35,31.11 43.05,31.11 38.48,35.69 v38.48,38.1 | v23.03,43.9 22.78,43.64 22.78,35.6 v22.73,35.56 | v56.52,23.75 56.52,27.18 55.88,27.81 v55.75,27.81 | v70.2,29.68 70.2,34.01 v70.87,34.67 | v55.88,62.23 53.34,62.23 v52.07,63.5 | v25.02,80.9 18.67,80.9 v17.78,80.01 | v10.92,35.69 13.84,38.61 15.11,38.61 15.21,38.7 WIFI.MTGND | v67.31,49.53 63.75,53.09 v63.75,54.86 64.26,54.86 65.02,55.63 v65.02,57.15 | v43.81,48.01 43.81,55.24 44.45,55.88 v57.19,55.88 | v40.89,81.28 44.58,81.28 v44.83,81.03 | v78.23,82.17 77.98,82.42 v76.2,82.42
  other vias: 15.3,38.7
  pour Top (isolate 0.254): 1.27,99.06 105.41,99.06 105.41,63.5 111.76,57.15 128.27,57.15 128.27,21.59 82.55,21.59 82.55,1.27 59.69,1.27 59.69,8.89 34.29,8.89 34.29,1.27 1.27,1.27 1.27,22.86 6.86,22.86 6.86,55.88 1.27,55.88
  pour Bottom: 1.27,99.06 105.41,99.06 105.41,63.5 111.76,57.15 128.27,57.15 128.27,21.59 82.55,21.59 82.55,1.27 59.69,1.27 59.69,8.89 34.29,8.89 34.29,1.27 1.27,1.27 1.27,22.86 6.86,22.86 6.86,55.88 1.27,55.88
GND-ISO
  Bottom 0.965: X6.1 86.36,17.78 88.9,20.32 Q5.3
  pour Top: 83.44,1.27 128.27,1.27 128.27,20.83 83.44,20.83
  pour Bottom: 83.44,20.83 128.27,20.83 128.27,1.27 83.44,1.27
MAX232_RX  (via drill 0.35)
  Top 0.305: U1.12 61.59,81.92 62.87,80.64 67.94,80.64 68.58,80.01 v68.58,78.74 | IC3.45 73.35,51.11 72.39,52.07 v72.25,51.94
  Bottom 0.305: v72.25,51.94 69.85,54.34 69.85,77.47 v68.58,78.74
MAX232_TX  (via drill 0.35)
  Top 0.305: U1.11 62.87,81.92 63.5,81.28 68.58,81.28 69.85,80.01 v69.85,78.74 | IC3.46 73.85,51.63 v72.9,52.58
  Bottom 0.305: v72.9,52.58 71.12,54.36 71.12,77.47 v69.85,78.74
MISO  (via drill 0.35)
  Top 0.305: SD1.7 5.76,17.57 6.22,18.03 v7.24,18.03 | WIFI.J17 15.9,23.52 v11.43,19.05 | R47.1 Q4.2 60.27,32.13 v61.47,32.13 | IC3.22 63.81,50.11 v63.88,50.04
  Top 0.406: R47.1 60.13,29.15 60.2,29.08 v60.2,29.21 | 5.71,16.46 SD1.7 | v30.48,19.05 v25.4,19.05
  Bottom 0.305: v11.43,19.05 10.41,18.03 v7.24,18.03 | v63.88,50.04 63.88,48.64 62.48,47.24 62.48,33.15 v61.47,32.13
  Bottom 0.406: v60.2,29.21 60.2,18.29 58.42,16.51 33.02,16.51 v30.48,19.05 | v25.4,19.05 v11.43,19.05
MISO_5V  (via drill 0.35)
  Top 0.305: Q4.3 60.13,35.32 R46.1 60.13,37.65 v60.2,37.72
  Bottom 0.305: v60.2,37.72 60.2,41.4 59.69,41.91 J2.1
MOSI  (via drill 0.35)
  Top 0.305: IC3.21 59.69,50.61 | 59.69,50.61 57.83,50.61 56.88,49.67 U5.4 | v59.69,50.29 59.69,50.61 | v57.15,44.45 v59.69,46.99
  Bottom 0.305: J2.4 57.15,40.64 v57.15,44.45 | v59.69,46.99 v59.69,50.29
MOSI_3V  (via drill 0.35, 0.41)
  Top 0.305: U5.16 21.11,50.33 v20.32,49.53 | WIFI.J15 13.84,31.81 | WIFI.J15 13.87,30.58 15.24,29.21 15.24,24.13 10.16,19.05 SD1.3 | WIFI.J15 13.87,34.39 12.7,35.56 12.7,41.15 v13.46,41.91
  Bottom 0.305: v20.32,49.53 15.24,49.53 13.97,48.26 13.46,47.75 v13.46,41.91
MTR_CTRL  (via drill 0.35)
  Top 0.305: IC3.15 65.01,53.61 v65.02,53.59 | v76.96,43.69 90.55,30.1 R57.2
  Bottom 0.305: v76.96,43.69 74.93,43.69 v65.02,53.59
N$1
  Top 0.305: F3.1 C14.1 | R19.2 32.7,80.96 33.02,80.64 33.02,74.7 L1.1
  Top 0.965: L1.1 32.45,72.73 C13.+ 47.46,69.72 F3.1
N$3
  Top 0.305: WIFI.J1 21.48,46.52 22.28,45.72 D8.C
N$4
  Top 0.305: R58.1 112.71,23.18 111.76,24.13 U8.1
N$9
  Top 0.305: X3.1 101.6,84.14 R4.2
N$10
  Top 0.305: WIFI.J27 23.66,42.83 D9.C
N$11
  Top 0.305: WIFI.J26 22.71,41.81 D10.C
N$12
  Top 0.305: WIFI.J10 8.79,28.99 R53.1
N$13
  Top 0.305: D10.A R42.2
N$14
  Top 0.305: D9.A R40.2
N$15
  Top 0.305: D8.A R38.2
N$18
  Top 0.406: U2.7 75.69,79.31 R23.1 74.93,80.08 74.93,83.1 D2.2 | R11.2 72.82,83.42 D2.2 | F1.1 75.06,83.61 D2.2
N$19
  Top 0.406: U2.6 76.96,79.57 R23.2 77.47,80.08 77.47,83.1 D2.1 | R12.1 79.58,83.42 D2.1 | F2.1 77.34,83.61 D2.1
N$20
  Top 0.305: X3.2 96.52,84.14 R3.2
N$21
  Top 0.305: U6.3 95.89,45.85 96.39,45.34 102.83,45.34 BT1.1
N$22
  Top 0.406: F1.2 72.26,87.5 X2.2
N$23
  Top 0.406: F2.2 80.14,87.5 X2.1
N$25
  Top 0.305: U6.1 93.34,44.86 Q3.1
N$26
  Top 0.305: U6.2 94.61,44.86 Q3.4
N$27
  Top 0.305: BLE.28 39.51,17.89 38.92,18.48 R62.2
N$30
  Top 0.305: X3.3 91.44,84.14 R2.2
N$31
  Top 0.305: R59.1 123.12,23.05 122.17,24 U9.1
N$32
  Top 0.305: X3.4 86.36,84.14 R1.2
N$33
  Top 0.305: WIFI.J22 23.91,37.75 R44.2 23.94,38.67 24.64,39.37 28.07,39.37 28.07,37.78 R45.1
N$34
  Top 0.305: WIFI.J11 9.8,30.44 9.95,30.3 9.95,27.59 10.54,26.99 R54.1
N$35
  Top 0.305: BLE.23 39.57,25.39 R56.1 R52.1 38.92,30.67 40.03,31.77 S2.1
N$36
  Top 0.254: U3.2 121.84,62.99 121.98,63.14 124.04,63.14 R30.1
N$37
  Top 0.254: U3.1 122.47,62.51 R29.2
N$38  (via drill 0.35, 0.41)
  Top 0.305: R9.1 v118.75,80.01 C5.2 R26.1 120.9,80.9 121.16,81.15 v122.05,81.15 | IC2.3 v122.05,70.48
  Bottom 0.305: v122.05,70.48 v122.05,81.15 | DOV101.A v118.75,80.01
N$39
  Top 0.305: U7.3 85.85,16.96 R63.2
N$40  (via drill 0.35, 0.41)
  Top 0.305: R10.1 v125.22,80.01 R27.2 | IC2.2 122.56,69.22 v123.19,69.85
  Bottom 0.305: v123.19,69.85 123.19,78.73 DOV100.A v125.22,80.01
N$42
  Top 0.305: R6.1 125.16,83.82 | 125.16,83.82 R10.2 | X4.1 125.16,88.2 125.16,83.82
N$44
  Top 0.305: D11.A 36.97,23.82 R60.2
N$45
  Bottom 0.305: X4.4 109.22,93.59 D108.A
N$48
  Top 0.305: R63.1 99.06,16.51 101.6,19.05 Q5.1
N$50
  Top 0.305: U8.3 109.22,16.83 R64.2
N$51  (via drill 0.35)
  Top 0.305: R7.2 108.78,83.82 R5.2 111.06,92.52 v112.52,93.98
  Bottom 0.305: v112.52,93.98 D108.C
N$52
  Bottom 0.305: X4.2 119.38,93.59 D107.A
N$53
  Bottom 0.406: X5.4 D103.A
N$54  (via drill 0.35)
  Top 0.406: RN1.8 75.1,15.07 76.2,13.97 v76.2,3.94
  Bottom 0.406: v76.2,3.94 78.48,3.94 D103.C
N$55  (via drill 0.35)
  Top 0.406: RN1.7 71.39,3.96 | 71.39,3.96 71.37,3.94 | 71.39,3.96 v71.5,3.96
  Bottom 0.406: v71.5,3.96 73.42,3.96 D104.C
N$56
  Bottom 0.406: X5.3 D104.A
N$57
  Bottom 0.406: X5.2 D105.A
N$58  (via drill 0.35, 0.41)
  Top 0.305: R7.1 v108.71,80.01 R24.1 C3.2 110.87,80.77 111.25,81.15 v111.89,81.15 | IC2.5 v115.31,72.89 v115.32,72.9
  Bottom 0.305: v115.32,72.9 114.05,72.9 111.89,75.06 v111.89,81.15 | DOV103.A v108.71,80.01
N$59  (via drill 0.41)
  Top 0.305: R8.1 v115.19,80.01 R25.2 115.89,79.69 116.84,78.74 116.84,76.2 113.92,73.28 113.92,70.87 114.3,70.48 IC2.6
  Bottom 0.305: DOV102.A v115.19,80.01
N$60  (via drill 0.35)
  Top 0.406: RN1.6 v70.59,3.96 70.61,3.94
  Bottom 0.406: v70.59,3.96 68.82,3.96 D105.C
N$61  (via drill 0.35)
  Top 0.305: R9.2 118.81,83.82 R6.2 121.1,92.39 v122.68,93.98
  Bottom 0.305: v122.68,93.98 D107.C
N$62
  Top 0.305: U9.3 119.63,16.7 R65.2
N$63
  Top 0.305: R5.1 115.12,83.82 | 115.12,83.82 R8.2 | X4.3 115.12,88.08 115.12,83.82
N$64  (via drill 0.35)
  Top 0.406: RN1.5 67.14,15.07 66.04,13.97 v66.04,3.81
  Bottom 0.406: v66.04,3.81 63.89,3.81 D106.C
N$65
  Bottom 0.406: X5.1 D106.A
N$66
  Top 0.305: R20.1 34.29,78.11 36.07,76.33 ZENER.2
N$67
  Top 0.305: U7.1 88.39,23.37 88.9,22.86 90.23,22.86 R57.1
N$68
  Bottom 0.965: D102.A 101.6,6.84 X6.4 99.06,13.97 Q5.2
N$69
  Top 0.965: IC1.2 16.08,66.08 D7.C 18.43,63.73 L1.2
N$70
  Top 0.965: D1.A 11.04,84.7 X1.2 X1.1
  Bottom 0.965: D109.C 14.73,89.41 X1.2
N$71  (via drill 0.41)
  Top 0.305: R18.1 R17.2 26.6,78.99 v25.02,78.99 | IC1.4 19.48,68.91 v19.56,68.83
  Bottom 0.305: v19.56,68.83 19.56,73.53 v25.02,78.99
N$72
  Top 0.305: R18.2 30.16,80.01 30.8,80.01 R19.1
N$73
  Top 0.305: R22.2 43.67,79.06 Q1.1 45.41,79.19 46.35,80.14 ZENER.1
N$74
  Top 0.305: R31.2 24.03,60.64 LED1.C
N$75
  Top 0.305: IC3.33 67.35,43.85 Q2.2 64.52,41.02 C24.2 64.58,38.1 R43.2
N$76
  Top 0.305: IC3.34 67.85,44.04 Q2.1 70.87,41.02 C25.2 70.8,38.1 R43.1
N$92
  Top 0.406: RN1.4 68.03,16.42 66.55,17.91 IC4.1
N$94
  Top 0.406: RN1.3 70.59,17.04 70.23,17.4 69.34,17.4 69.09,17.65 IC4.3
N$96
  Top 0.406: RN1.2 71.39,17.16 71.63,17.4 IC4.5
N$98
  Top 0.406: RN1.1 73.19,16.42 74.17,17.4 IC4.7
N$112
  Top 0.406: U1.1 56.52,75.63 C8.2
N$113
  Top 0.406: C8.1 59.05,76.27 U1.3
N$114
  Top 0.406: C9.1 60.33,75.37 U1.4
N$115
  Top 0.406: U1.5 61.59,75.63 C9.2
N$116
  Top 0.406: C2.2 56.96,79.06 57.78,78.23 U1.2
N$117
  Top 0.406: U1.6 62.87,76.83 64.2,75.5 C10.2
N$122
  Top 0.305: R64.1 112.14,16.51 113.54,17.91 Q6.1
N$123
  Top 0.305: R65.1 122.49,16.38 123.89,17.78 Q7.1
N$126
  Top 0.406: Q7.3 126.24,15.37 125.35,14.48 121.16,14.48 119.38,12.7 X7.3
  Bottom 0.406: D100.A 119.77,11.04 X7.3
N$127
  Top 0.406: Q6.3 115.57,16.76 115.57,15.24 114.81,14.48 110.87,14.48 109.09,12.7 109.22,12.57 X7.1
  Bottom 0.508: X7.1 109.22,6.74 D101.A
ON/OFF
  Top 0.305: R28.1 21.18,67.4 IC1.5 23.42,70.41 24.13,71.12 24.13,81.28 25.4,82.55 38.1,82.55 | Q1.3 41.7,82.51 41.66,82.55 38.1,82.55 | R21.1 37.15,78.74 38.1,78.74 38.1,82.55
PROG_RX0  (via drill 0.35)
  Top 0.305: IC3.2 59.35,60.11 v58.67,59.44
  Bottom 0.305: v58.67,59.44 34.04,59.44 26.67,52.07 26.67,16.16 PROG.2
PROG_TX0  (via drill 0.35)
  Top 0.305: IC3.3 60.75,59.61 v59.94,58.8
  Bottom 0.305: v59.94,58.8 59.31,58.17 34.04,58.17 27.94,52.07 27.94,15.39 PROG.3
R1IN
  Top 0.305: U1.13 60.15,82.99 60.15,86.04 59.24,86.94 56.82,86.94 54.1,89.66 49.3,89.66 J1.3
RELAY_1
  Top 0.305: R58.2 114.05,26.54 112.9,27.69 94.23,27.69 81.28,40.64 81.28,48.26 79.93,49.61 IC3.53
RELAY_2
  Top 0.305: IC3.54 80.7,50.11 82.55,48.26 82.55,40.64 94.61,28.57 122.56,28.57 124.59,26.54 R59.2
RESET  (via drill 0.35)
  Top 0.254: v29.21,33.02 31.75,35.56
  Top 0.305: IC3.30 65.85,45.53 60.96,40.64 54.61,40.64 J2.5 52.07,41.91 51.31,41.15 46.35,41.15 | R41.1 44.45,41.15 | 44.45,41.15 46.35,41.15 | S1.2 46.33,41.12 46.35,41.15 | 31.75,35.56 35.81,39.62 43.69,39.62 44.2,40.13 44.2,40.89 44.45,41.15
  Bottom 0.254: v29.21,33.02 29.21,16.51 29.19,16.49 PROG.1
RS485_CTRL
  Top 0.305: IC3.76 75.85,71.97 U2.2 U2.3
RS485_RX  (via drill 0.35)
  Top 0.305: IC3.63 76.82,54.61 75.74,55.69 75.74,60.9 77.72,62.87 77.72,68.59 v76.83,69.47 | v74.42,70.23 U2.1
  Bottom 0.305: v76.83,69.47 75.31,69.47 74.42,70.36 v74.42,70.23
RS485_TX
  Top 0.305: U2.4 78.23,62.61 76.2,60.58 76.2,55.88 76.97,55.11 IC3.64
SCK  (via drill 0.35)
  Top 0.305: IC3.20 57.46,51.11 56.67,50.33 U5.5 52.23,50.33 v52.2,50.29
  Bottom 0.305: v52.2,50.29 52.2,48.13 55.88,44.45 J2.3
SCK_3V  (via drill 0.35)
  Top 0.305: U5.15 20.5,50.98 v17.78,48.26 | v16.89,33.66 16.89,31.81 WIFI.J18 16.92,23.27 v15.24,21.59 | v8,19.43 8,16.55 SD1.5
  Bottom 0.305: v17.78,48.26 17.78,34.54 v16.89,33.66 | v15.24,21.59 11.43,21.59 9.27,19.43 v8,19.43
SCL  (via drill 0.35)
  Top 0.254: v114.3,62.23 114.58,62.51 U3.10
  Top 0.305: U6.6 95.89,54.16 R37.2 95.69,54.61 v96.47,54.61 | v71.63,49.66 71.63,49.15 72.35,48.43 IC3.43
  Bottom 0.254: 96.52,58.42 100.33,62.23 v114.3,62.23
  Bottom 0.305: v71.63,49.66 74.35,52.38 74.35,55.94 77.53,59.13 95.81,59.13 96.52,58.42 96.52,54.61 v96.47,54.61
SD_CS_3V  (via drill 0.35)
  Top 0.305: U5.17 21.73,49.67 v20.32,48.26 | SD1.2 11.26,17.61 v13.59,19.94
  Bottom 0.305: v20.32,48.26 20.32,24.13 16.13,19.94 v13.59,19.94
SD_CS_5V
  Top 0.305: R32.1 48.26,56.01 49.78,54.48 49.78,51.44 52.19,49.02 U5.3 57.14,49.02 57.4,49.28 57.68,49.57 57.73,49.61 IC3.23
SD_DETECT  (via drill 0.35)
  Top 0.305: IC3.1 58.7,60.61 v58.67,60.58 | v4.19,22.23 4.19,19.75 R61.2
  Top 0.406: SD1.9 3.56,18.99 R61.2
  Bottom 0.305: v58.67,60.58 21.21,60.58 8.38,47.75 8.38,26.42 v4.19,22.23
SDA  (via drill 0.35)
  Top 0.254: U3.9 100.58,62.99 v95.5,57.91
  Top 0.305: U6.5 97.16,56.64 R36.2 95.5,56.7 v95.5,57.91 | v72.67,49.66 72.67,49.63 72.85,49.45 IC3.44
  Bottom 0.305: v72.67,49.66 75.06,52.05 75.06,55.63 77.85,58.42 95,58.42 v95.5,57.91
T1OUT
  Top 0.305: J1.2 52.53,86.36 58.93,86.36 59.44,85.85 59.44,83.57 59.05,83.19 U1.14
VCCA  (via drill 0.41)
  Top 0.279: C16.2 117.16,63.18 116.84,63.5 U3.8 114.3,63.5 113.03,64.77 113.03,65.79 113.03,67.94 IC2.8
  Top 0.305: R30.2 124.97,59.18 117.16,59.18 C16.2 | v112.65,68.33 113.03,67.94 | v118.75,74.93 v124.33,74.93 | v113.03,75.18 112.78,74.93 v109.35,74.93 109.22,74.93
  Top 0.508: FB2.1 113.03,65.79
  Bottom 0.305: DOV103.C 108.71,74.93 | 108.71,74.93 108.71,72.26 v112.65,68.33 | v118.75,74.93 DOV101.C DOV102.C 113.66,75.18 v113.03,75.18 | v124.33,74.93 125.22,75.82 DOV100.C | v109.35,74.93 108.71,74.93
WAKE_3V  (via drill 0.35)
  Top 0.305: U5.13 19.25,52.27 v17.78,50.8 | v11.05,30.35 R54.2
  Bottom 0.305: v17.78,50.8 15.11,50.8 9.78,45.47 9.78,31.62 v11.05,30.35
WAKE_5V
  Top 0.305: IC3.18 61.81,52.07 56.63,52.07 56.19,51.62 U5.7
(copper drawn outside any net)
  shapes: Top area x2

## Text on the board
tNames: TechYantra